# Altium schematic sheet 0-main.SchDoc
size A3
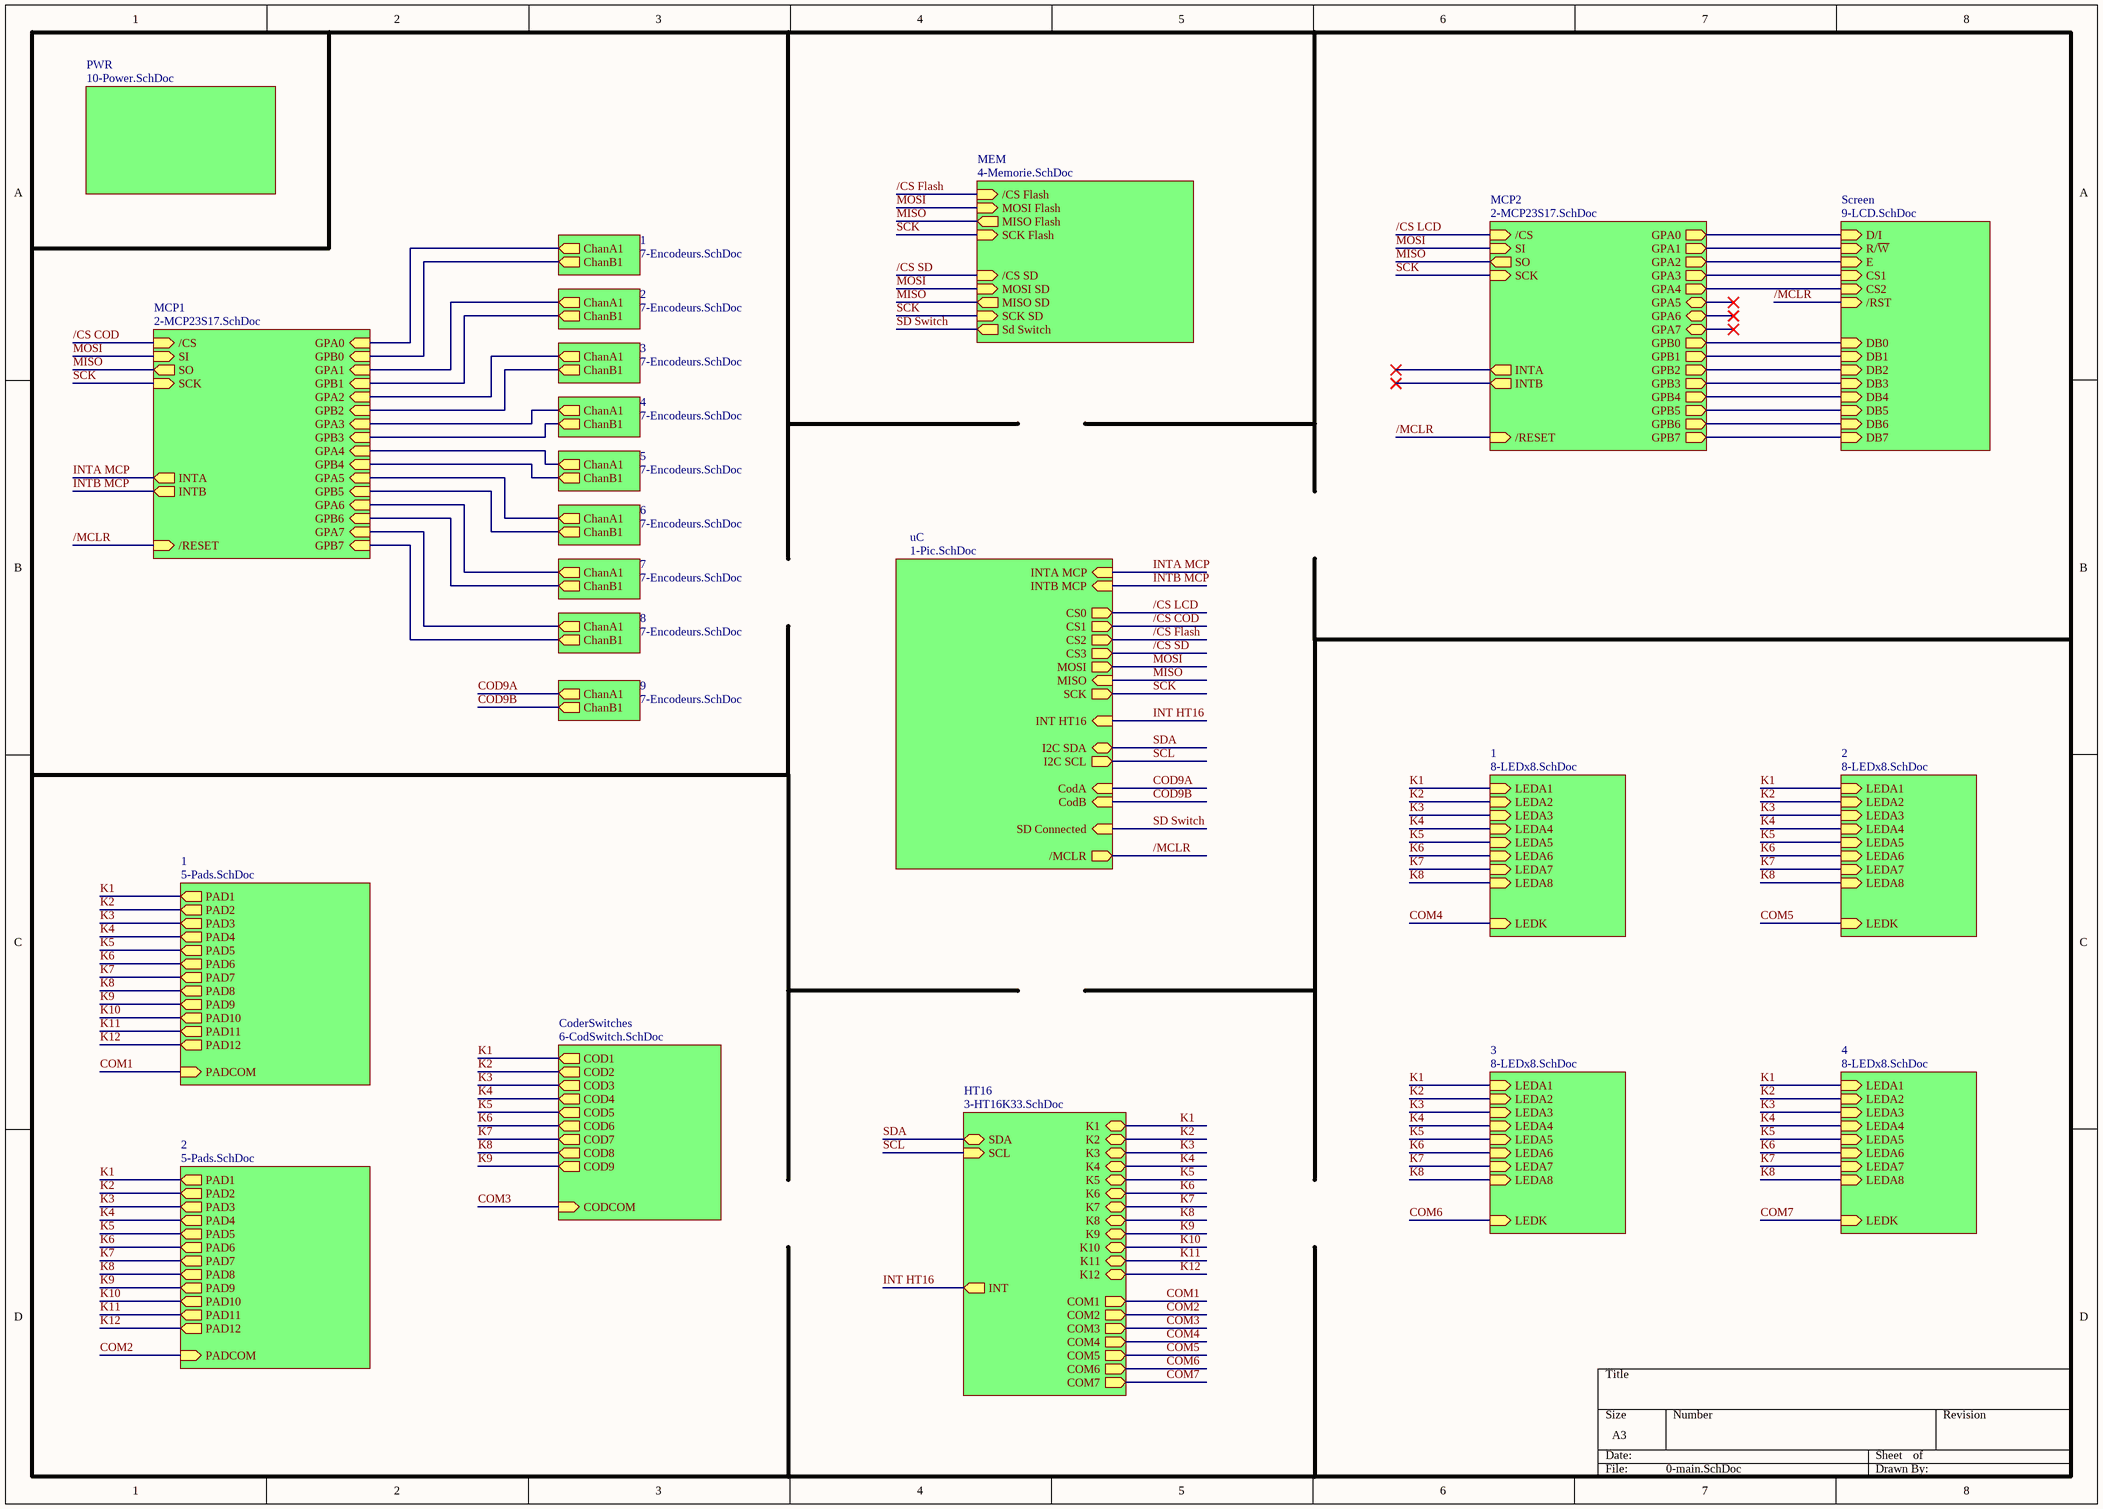
[diagram p0: 0-main.SchDoc]

## Sub-sheets
1 = 7-Encodeurs.SchDoc: ChanA1 (out), ChanB1 (out)
1 = 8-LEDx8.SchDoc: LEDA1 (in), LEDA2 (in), LEDA4 (in), LEDA3 (in), LEDA5 (in), LEDA6 (in), LEDA7 (in), LEDA8 (in), LEDK (in)
1 = 5-Pads.SchDoc: PAD1 (out), PAD2 (out), PAD3 (out), PAD4 (out), PAD5 (out), PAD6 (out), PAD8 (out), PAD7 (out), PAD9 (out), PAD10 (out), PAD11 (out), PAD12 (out), PADCOM (in)
2 = 7-Encodeurs.SchDoc: ChanA1 (out), ChanB1 (out)
2 = 5-Pads.SchDoc: PAD1 (out), PAD2 (out), PAD3 (out), PAD4 (out), PAD5 (out), PAD6 (out), PAD8 (out), PAD7 (out), PAD9 (out), PAD10 (out), PAD11 (out), PAD12 (out), PADCOM (in)
2 = 8-LEDx8.SchDoc: LEDA1 (in), LEDA2 (in), LEDA4 (in), LEDA3 (in), LEDA5 (in), LEDA6 (in), LEDA7 (in), LEDA8 (in), LEDK (in)
3 = 7-Encodeurs.SchDoc: ChanA1 (out), ChanB1 (out)
3 = 8-LEDx8.SchDoc: LEDA1 (in), LEDA2 (in), LEDA4 (in), LEDA3 (in), LEDA5 (in), LEDA6 (in), LEDA7 (in), LEDA8 (in), LEDK (in)
4 = 7-Encodeurs.SchDoc: ChanA1 (out), ChanB1 (out)
4 = 8-LEDx8.SchDoc: LEDA1 (in), LEDA2 (in), LEDA4 (in), LEDA3 (in), LEDA5 (in), LEDA6 (in), LEDA7 (in), LEDA8 (in), LEDK (in)
5 = 7-Encodeurs.SchDoc: ChanA1 (out), ChanB1 (out)
6 = 7-Encodeurs.SchDoc: ChanA1 (out), ChanB1 (out)
7 = 7-Encodeurs.SchDoc: ChanA1 (out), ChanB1 (out)
8 = 7-Encodeurs.SchDoc: ChanA1 (out), ChanB1 (out)
9 = 7-Encodeurs.SchDoc: ChanA1 (out), ChanB1 (out)
CoderSwitches = 6-CodSwitch.SchDoc: COD1 (out), COD2 (out), COD3 (out), COD4 (out), COD5 (out), COD6 (out), COD7 (out), COD8 (out), CODCOM (in), COD9 (out)
HT16 = 3-HT16K33.SchDoc: SDA (bidir), SCL (in), COM3 (out), COM2 (out), COM1 (out), K1 (bidir), K2 (bidir), K4 (bidir), K3 (bidir), K5 (bidir), K6 (bidir), K7 (bidir), K8 (bidir), K9 (bidir), K10 (bidir), K11 (bidir), INT (out), K12 (bidir), COM4 (out), COM5 (out), COM6 (out), COM7 (out)
MCP1 = 2-MCP23S17.SchDoc: GPA0 (in), GPB0 (in), GPA1 (in), GPB1 (in), GPA2 (in), GPA3 (in), GPB2 (in), GPB3 (in), GPA4 (in), GPB4 (in), GPA5 (in), GPB5 (in), GPA6 (in), GPB6 (in), GPA7 (in), GPB7 (in), INTA (out), INTB (out), /CS (in), SCK (in), SI (in), SO (out), /RESET (in)
MCP2 = 2-MCP23S17.SchDoc: INTA (out), INTB (out), /CS (in), SCK (in), SI (in), SO (out), /RESET (in), GPA0 (out), GPB0 (out), GPA1 (out), GPB1 (out), GPA2 (out), GPA3 (out), GPB2 (out), GPB3 (out), GPA4 (out), GPB4 (out), GPA5 (bidir), GPB5 (out), GPA6 (bidir), GPB6 (out), GPA7 (bidir), GPB7 (out)
MEM = 4-Memorie.SchDoc: /CS Flash (in), MOSI Flash (in), MISO Flash (out), SCK Flash (in), /CS SD (in), MISO SD (out), MOSI SD (in), SCK SD (in), Sd Switch (out)
PWR = 10-Power.SchDoc: no entries
Screen = 9-LCD.SchDoc: D/I (in), E (in), CS1 (in), CS2 (in), DB0 (in), DB1 (in), DB2 (in), DB3 (in), DB4 (in), DB5 (in), DB6 (in), DB7 (in), /RST (in), R/~{W} (in)
uC = 1-Pic.SchDoc: CodA (in), CodB (in), SCK (out), MOSI (out), MISO (in), CS2 (out), CS1 (out), CS0 (out), INTB MCP (in), INTA MCP (in), I2C SCL (out), I2C SDA (bidir), SD Connected (in), /MCLR (out), CS3 (out), INT HT16 (in)

## Nets
/CS COD: sheet uC/CS1, sheet MCP1//CS
/CS Flash: sheet uC/CS2, sheet MEM//CS Flash
/CS LCD: sheet uC/CS0, sheet MCP2//CS
/CS SD: sheet uC/CS3, sheet MEM//CS SD
/MCLR: sheet uC//MCLR, sheet MCP1//RESET, sheet MCP2//RESET, sheet Screen//RST
COD9A: sheet uC/CodA, sheet 9/ChanA1
COD9B: sheet uC/CodB, sheet 9/ChanB1
COM1: sheet HT16/COM1, sheet 1/PADCOM
COM2: sheet HT16/COM2, sheet 2/PADCOM
COM3: sheet HT16/COM3, sheet CoderSwitches/CODCOM
COM4: sheet HT16/COM4, sheet 1/LEDK
COM5: sheet HT16/COM5, sheet 2/LEDK
COM6: sheet HT16/COM6, sheet 3/LEDK
COM7: sheet HT16/COM7, sheet 4/LEDK
INT HT16: sheet uC/INT HT16, sheet HT16/INT
INTA MCP: sheet uC/INTA MCP, sheet MCP1/INTA
INTB MCP: sheet uC/INTB MCP, sheet MCP1/INTB
K1: sheet HT16/K1, sheet 1/LEDA1, sheet CoderSwitches/COD1, sheet 2/PAD1, sheet 2/LEDA1, sheet 3/LEDA1, sheet 4/LEDA1, sheet 1/PAD1
K2: sheet HT16/K2, sheet 1/LEDA2, sheet CoderSwitches/COD2, sheet 2/PAD2, sheet 2/LEDA2, sheet 3/LEDA2, sheet 4/LEDA2, sheet 1/PAD2
K3: sheet HT16/K3, sheet 1/LEDA3, sheet CoderSwitches/COD3, sheet 2/PAD3, sheet 2/LEDA3, sheet 3/LEDA3, sheet 4/LEDA3, sheet 1/PAD3
K4: sheet HT16/K4, sheet 1/LEDA4, sheet CoderSwitches/COD4, sheet 2/PAD4, sheet 2/LEDA4, sheet 3/LEDA4, sheet 4/LEDA4, sheet 1/PAD4
K5: sheet HT16/K5, sheet 1/LEDA5, sheet CoderSwitches/COD5, sheet 2/PAD5, sheet 2/LEDA5, sheet 3/LEDA5, sheet 4/LEDA5, sheet 1/PAD5
K6: sheet HT16/K6, sheet 1/LEDA6, sheet CoderSwitches/COD6, sheet 2/PAD6, sheet 2/LEDA6, sheet 3/LEDA6, sheet 4/LEDA6, sheet 1/PAD6
K7: sheet HT16/K7, sheet 1/LEDA7, sheet CoderSwitches/COD7, sheet 2/PAD7, sheet 2/LEDA7, sheet 3/LEDA7, sheet 4/LEDA7, sheet 1/PAD7
K8: sheet HT16/K8, sheet 1/LEDA8, sheet CoderSwitches/COD8, sheet 2/PAD8, sheet 2/LEDA8, sheet 3/LEDA8, sheet 4/LEDA8, sheet 1/PAD8
K9: sheet HT16/K9, sheet CoderSwitches/COD9, sheet 2/PAD9, sheet 1/PAD9
K10: sheet HT16/K10, sheet 2/PAD10, sheet 1/PAD10
K11: sheet HT16/K11, sheet 2/PAD11, sheet 1/PAD11
K12: sheet HT16/K12, sheet 2/PAD12, sheet 1/PAD12
MISO: sheet uC/MISO, sheet MCP1/SO, sheet MEM/MISO Flash, sheet MEM/MISO SD, sheet MCP2/SO
MOSI: sheet uC/MOSI, sheet MCP1/SI, sheet MEM/MOSI Flash, sheet MEM/MOSI SD, sheet MCP2/SI
SCK: sheet uC/SCK, sheet MCP1/SCK, sheet MEM/SCK Flash, sheet MEM/SCK SD, sheet MCP2/SCK
SCL: sheet uC/I2C SCL, sheet HT16/SCL
SD Switch: sheet uC/SD Connected, sheet MEM/Sd Switch
SDA: sheet uC/I2C SDA, sheet HT16/SDA
(unnamed): sheet 1/ChanA1, sheet MCP1/GPA0
(unnamed): sheet 1/ChanB1, sheet MCP1/GPB0
(unnamed): sheet MCP1/GPA1, sheet 2/ChanA1
(unnamed): sheet MCP1/GPB1, sheet 2/ChanB1
(unnamed): sheet MCP1/GPA2, sheet 3/ChanA1
(unnamed): sheet MCP1/GPA3, sheet 4/ChanA1
(unnamed): sheet MCP1/GPB2, sheet 3/ChanB1
(unnamed): sheet MCP1/GPB3, sheet 4/ChanB1
(unnamed): sheet MCP1/GPA4, sheet 5/ChanA1
(unnamed): sheet MCP1/GPB4, sheet 5/ChanB1
(unnamed): sheet MCP1/GPA5, sheet 6/ChanA1
(unnamed): sheet MCP1/GPB5, sheet 6/ChanB1
(unnamed): sheet MCP1/GPA6, sheet 7/ChanA1
(unnamed): sheet MCP1/GPB6, sheet 7/ChanB1
(unnamed): sheet MCP1/GPA7, sheet 8/ChanA1
(unnamed): sheet MCP1/GPB7, sheet 8/ChanB1
(unnamed): sheet MCP2/GPA0, sheet Screen/D/I
(unnamed): sheet MCP2/GPB0, sheet Screen/DB0
(unnamed): sheet MCP2/GPA1, sheet Screen/R/~{W}
(unnamed): sheet MCP2/GPB1, sheet Screen/DB1
(unnamed): sheet MCP2/GPA2, sheet Screen/E
(unnamed): sheet MCP2/GPA3, sheet Screen/CS1
(unnamed): sheet MCP2/GPB2, sheet Screen/DB2
(unnamed): sheet MCP2/GPB3, sheet Screen/DB3
(unnamed): sheet MCP2/GPA4, sheet Screen/CS2
(unnamed): sheet MCP2/GPB4, sheet Screen/DB4
(unnamed): sheet MCP2/GPB5, sheet Screen/DB5
(unnamed): sheet MCP2/GPB6, sheet Screen/DB6
(unnamed): sheet MCP2/GPB7, sheet Screen/DB7